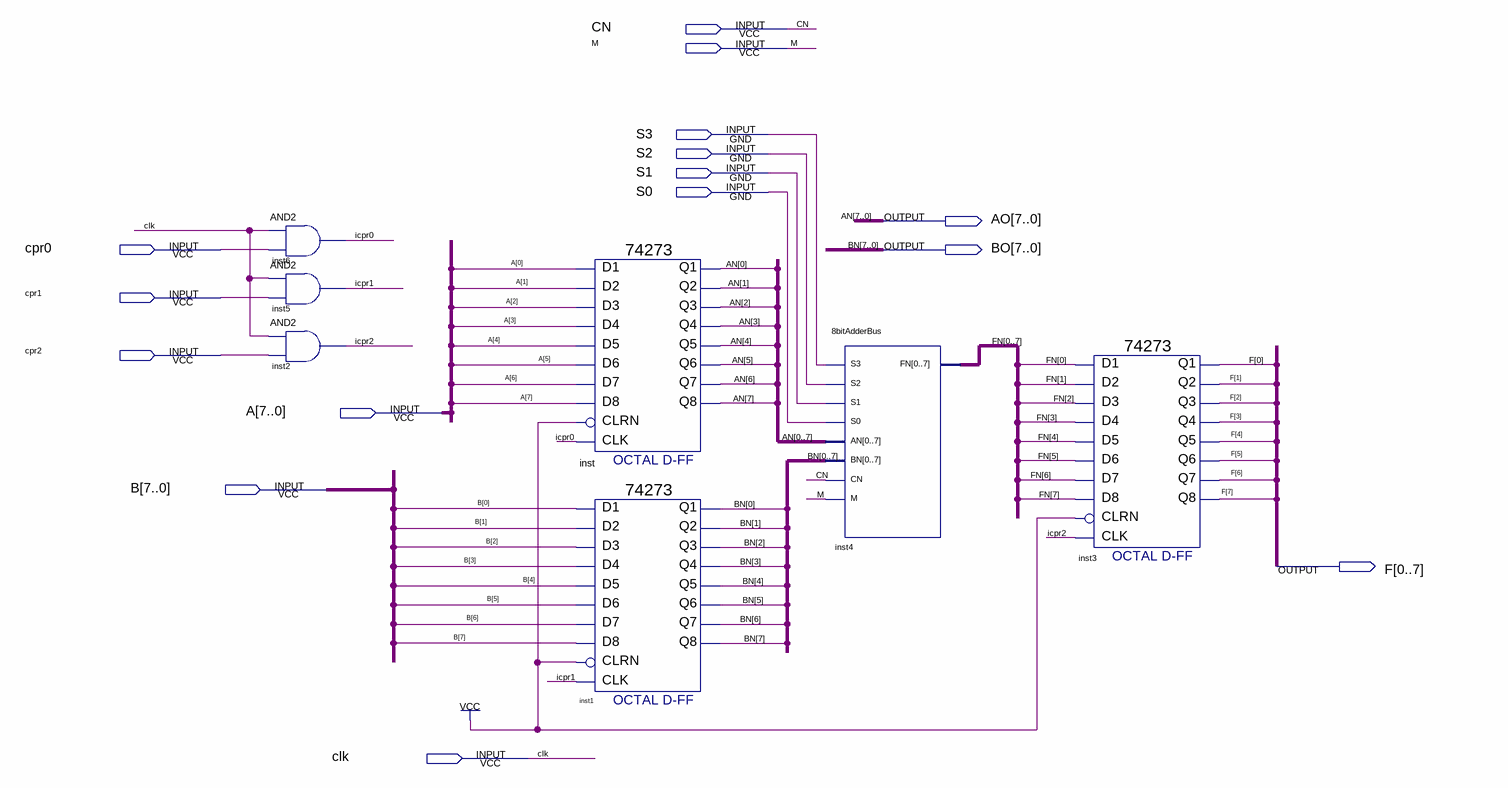
[diagram p0: schematic sheet]
// Quartus schematic alu.bdf as structural Verilog: 7 symbols, 15 pins
module alu (
  input  CN,
  input  M,
  input  S3,
  input  S2,
  input  S1,
  input  S0,
  input  cpr0,
  input  cpr1,
  input  cpr2,
  input  [7:0] A,
  input  [7:0] B,
  input  clk,
  output [7:0] AO,
  output [7:0] BO,
  output [0:7] F
);

  wire icpr0, icpr1, icpr2;
  wire [7:0] FN;

  and inst6 (icpr0, clk, cpr0);
  and inst5 (icpr1, clk, cpr1);
  and inst2 (icpr2, clk, cpr2);
  \74273  inst (
    .D2(A[1]), .D3(A[2]), .D1(A[0]), .D4(A[3]), .D7(A[6]), .D6(A[5]), .D5(A[4]), .D8(A[7]), .CLK(icpr0),
    .CLRN(1'b1), .Q4(AO[3]), .Q1(AO[0]), .Q2(AO[1]), .Q3(AO[2]), .Q6(AO[5]), .Q5(AO[4]), .Q7(AO[6]),
    .Q8(AO[7]));
  \74273  inst1 (
    .D2(B[1]), .D3(B[2]), .D1(B[0]), .D4(B[3]), .D7(B[6]), .D6(B[5]), .D5(B[4]), .D8(B[7]), .CLK(icpr1),
    .CLRN(1'b1), .Q4(BO[3]), .Q1(BO[0]), .Q2(BO[1]), .Q3(BO[2]), .Q6(BO[5]), .Q5(BO[4]), .Q7(BO[6]),
    .Q8(BO[7]));
  \8bitAdderBus  inst4 (
    .S3(S3), .S2(S2), .S1(S1), .S0(S0), .AN({AO[0], AO[1], AO[2], AO[3], AO[4], AO[5], AO[6], AO[7]}),
    .BN({BO[0], BO[1], BO[2], BO[3], BO[4], BO[5], BO[6], BO[7]}), .CN(CN), .M(M),
    .FN({FN[0], FN[1], FN[2], FN[3], FN[4], FN[5], FN[6], FN[7]}));
  \74273  inst3 (
    .D2(FN[1]), .D3(FN[2]), .D1(FN[0]), .D4(FN[3]), .D7(FN[6]), .D6(FN[5]), .D5(FN[4]), .D8(FN[7]),
    .CLK(icpr2), .CLRN(1'b1), .Q4(F[3]), .Q1(F[0]), .Q2(F[1]), .Q3(F[2]), .Q6(F[5]), .Q5(F[4]), .Q7(F[6]),
    .Q8(F[7]));

  // Other names for the same wires on the sheet: AN[7:0] = AO; BN[7:0] = BO
endmodule
